# Altium schematic sheet UC3842第三版.SchDoc
size 457 x 241 mm; SheetNumber: 1; SheetTotal: 1
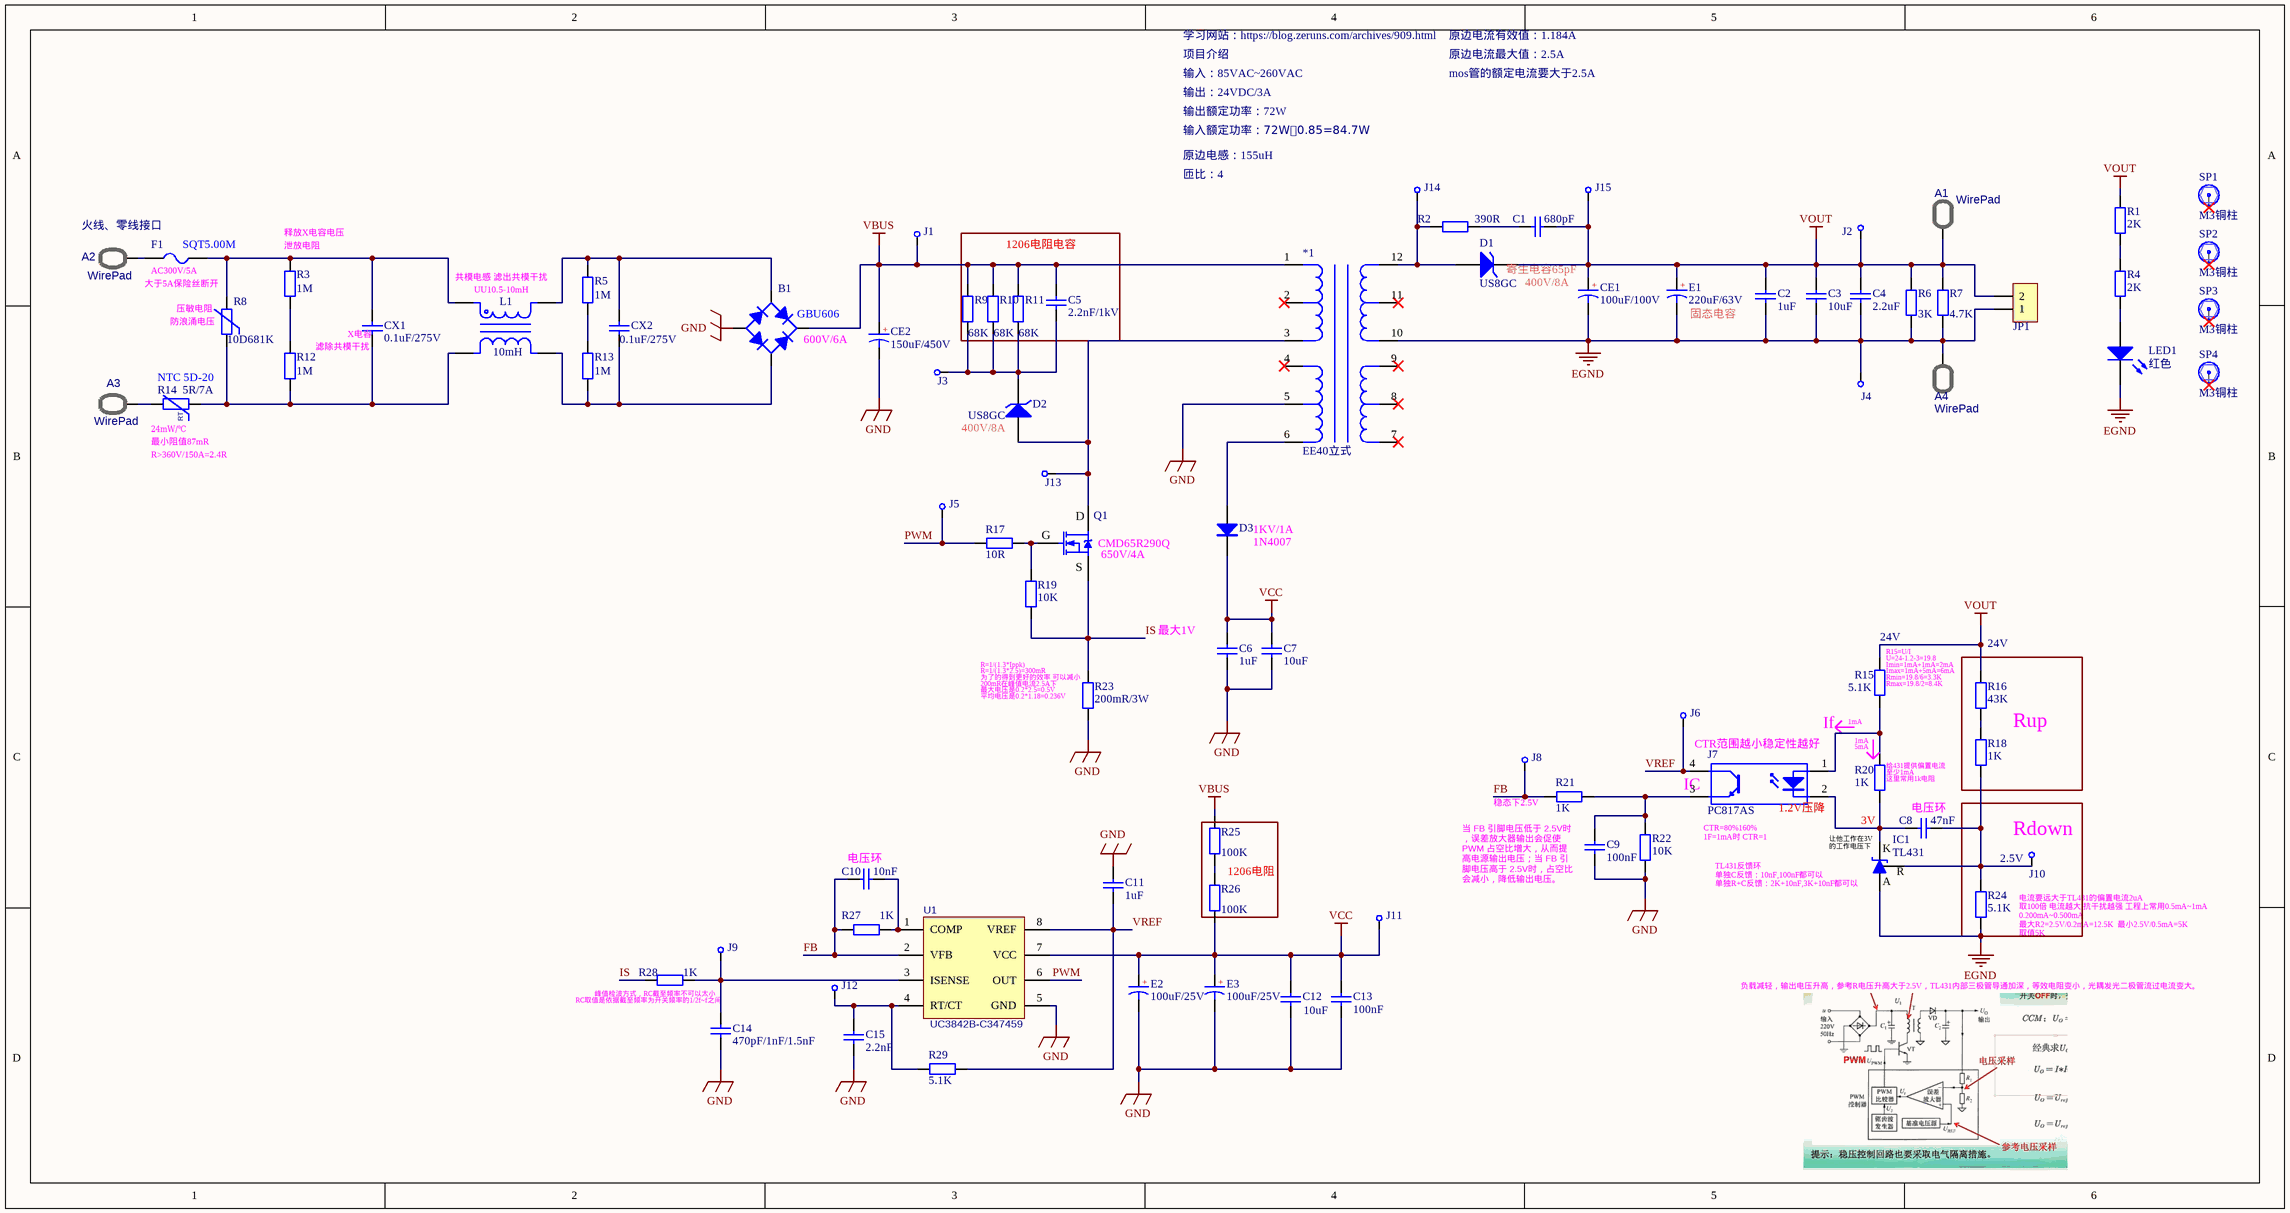
[diagram p0: UC3842第三版.SchDoc]

## Parts
*1  EE40立式  [EE40立式]
A1  WirePad  [WirePad-4.5x7]  (no BOM)
A2  WirePad  [WirePad-4.5x7]  (no BOM)
A3  WirePad  [WirePad-4.5x7]  (no BOM)
A4  WirePad  [WirePad-4.5x7]  (no BOM)
B1  GBU606  [GBU]
C1  680pF  [C0805_L]
C2  1uF  [C0805_L]
C3  10uF  [C0805_L]
C4  2.2uF  [C0805_L]
C5  2.2nF/1kV  [C0805_L]
C6  1uF  [C0805_L]
C7  10uF  [C0805_L]
C8  47nF  [C0805_L]
C9  100nF  [C0805_L]
C10  10nF  [C0805_L]
C11  1uF  [C0805_L]
C12  10uF  [C0805_L]
C13  100nF  [C0805_L]
C14  470pF/1nF/1.5nF  [C0805_L]
C15  2.2nF  [C0805_L]
CE1  100uF/100V  [CE-5.0*10*16]
CE2  150uF/450V  [CE-7.5*18*35.5-H - BK]
CX1  0.1uF/275V  [CX 10*13*11]
CX2  0.1uF/275V  [CX 10*13*11]
D1  US8GC  [SMC]
D2  US8GC  [SMC]
D3  1N4007  [SMA]
E1  220uF/63V  [CT 5.0*10*13 - R]
E2  100uF/25V  [CE D(6.3*5.4)]
E3  100uF/25V  [CE D(6.3*5.4)]
F1  SQT5.00M  [FUSE-8.5x4.0-392Series]
IC1  TL431  [SOT23-3N]
J1  CHECK  [CHECK-A]  (value not drawn)
J2  CHECK  [CHECK-A]  (value not drawn)
J3  CHECK  [CHECK-A]  (value not drawn)
J4  CHECK  [CHECK-A]  (value not drawn)
J5  CHECK  [CHECK-A]  (value not drawn)
J6  CHECK  [CHECK-A]  (value not drawn)
J7  PC817AS  [SOP4-W2.54_M]
J8  CHECK  [CHECK-A]  (value not drawn)
J9  CHECK  [CHECK-A]  (value not drawn)
J10  CHECK  [CHECK-A]  (value not drawn)
J11  CHECK  [CHECK-A]  (value not drawn)
J12  CHECK  [CHECK-A]  (value not drawn)
J13  CHECK  [CHECK-A]  (value not drawn)
J14  CHECK  [CHECK-A]  (value not drawn)
J15  CHECK  [CHECK-A]  (value not drawn)
JP1  HDR-1X2  [KF301-5.0-2P]  (value not drawn)
L1  10mH  [UU9.8]
LED1  红色  [LED0805_G]
Q1  CMD65R290Q  [TO252]
R1  2K  [R0805_L]
R2  390R  [R0805_L]
R3  1M  [R1206_L]
R4  2K  [R0805_L]
R5  1M  [R1206_L]
R6  3K  [R1206_L]
R7  4.7K  [R1206_L]
R8  10D681K  [VDR 9D-4.5]
R9  68K  [R1206_L]
R10  68K  [R1206_L]
R11  68K  [R1206_L]
R12  1M  [R1206_L]
R13  1M  [R1206_L]
R14  5R/7A  [NTC-5D-20]
R15  5.1K  [R0805_L]
R16  43K  [R0805_L]
R17  10R  [R0805_L]
R18  1K  [R0805_L]
R19  10K  [R0805_L]
R20  1K  [R0805_L]
R21  1K  [R0805_L]
R22  10K  [R0805_L]
R23  200mR/3W  [R2512_M]
R24  5.1K  [R0805_L]
R25  100K  [R1206_L]
R26  100K  [R1206_L]
R27  1K  [R0805_L]
R28  1K  [R0805_L]
R29  5.1K  [R0805_L]
SP1  M3铜柱  [M3x9_L]
SP2  M3铜柱  [M3x9_L]
SP3  M3铜柱  [M3x9_L]
SP4  M3铜柱  [M3x9_L]
U1  UC3842B-C347459  [SOIC-8_150mil]

## Blocks framed on the sheet
1206电阻电容: C5 R9-R11
Rup: R16 R18
1206电阻: R25 R26
Rdown: J10 R24

## Nets
EGND: *1.10 A4.1 C2.1 C3.1 C4.1 CE1.2 E1.2 IC1.3(A) J4.1 JP1.1 LED1.2(K) R6.1 R7.1 R24.1
GND: *1.5 B1.DC- C6.1 C7.1 C9.2 C11.1 C12.2 C13.2 C14.1 C15.1 CE2.2 E2.2 E3.2 R22.2 R23.1 U1.5(GND)
VBUS: *1.1 B1.DC+ C5.2 CE2.1 J1.1 R9.2 R10.2 R11.2 R25.2
VCC: C6.2 C7.2 C12.1 C13.1 D3.2(K) E2.1 E3.1 J11.1 R26.1 U1.7(VCC)
VOUT: A1.1 C1.1 C2.2 C3.2 C4.2 CE1.1 D1.2(K) E1.1 J2.1 J15.1 JP1.2 R1.2 R6.2 R7.2 R15.2 R16.2
FB: C10.2 J8.1 R21.2 R27.1 U1.2(VFB)
IS: Q1.3(S) R19.2 R23.2 R28.1
PWM: J5.1 R17.2 U1.6(OUT)
VREF: C11.2 J6.1 J7.4(C) R29.2 U1.8(VREF)
Net*1_3: *1.3 D2.1(A) J13.1 Q1.2
Net*1_6: *1.6 D3.1(A)
Net*1_12: *1.12 D1.1(A) J14.1 R2.2
NetA2_1: A2.1 F1.2
NetA3_1: A3.1 R14.2
NetB1_AC1: B1.AC1 CX2.2 L1.2 R5.2
NetB1_AC2: B1.AC2 CX2.1 L1.3 R13.1
NetC1_2: C1.2 R2.1
NetC5_1: C5.1 D2.2(K) J3.1 R9.1 R10.1 R11.1
NetC8_1: C8.1 IC1.1(R) J10.1 R18.1 R24.2
NetC8_2: C8.2 IC1.2(K) J7.2(K) R20.1
NetC9_1: C9.1 J7.3(E) R21.1 R22.1
NetC10_1: C10.1 R27.2 U1.1(COMP)
NetC14_2: C14.2 J9.1 R28.2 U1.3(ISENSE)
NetC15_2: C15.2 J12.1 R29.1 U1.4(RT/CT)
NetCX1_1: CX1.1 L1.4 R8.1 R12.1 R14.1
NetCX1_2: CX1.2 F1.1 L1.1 R3.2 R8.2
NetJ7_1: J7.1(A) R15.1 R20.2
NetLED1_1: LED1.1(A) R4.1
NetQ1_1: Q1.1(G) R17.1 R19.1
NetR1_1: R1.1 R4.2
NetR3_1: R3.1 R12.2
NetR5_1: R5.1 R13.2
NetR16_1: R16.1 R18.2
NetR25_1: R25.1 R26.2

Not connected (* = marked no-connect by the designer): *1 2* 4* 7* 8* 9* 11*; SP1 1*; SP2 1*; SP3 1*; SP4 1*

## Notes on the sheet
- 学习网站：https://blog.zeruns.com/archives/909.html
- 项目介绍
- 输入：85VAC~260VAC
- 输出：24VDC/3A
- 原边电流有效值：1.184A
- mos管的额定电流要大于2.5A
- 原边电流最大值：2.5A
- 输出额定功率：72W
- 输入额定功率：72W➗0.85=84.7W
- 原边电感：155uH
- 匝比：4
- (near A2) 火线、零线接口
- (near F1) AC300V/5A
- (near R3) 泄放电阻
- (near R3) 释放X电容电压
- (near L1) 共模电感 滤出共模干扰
- (near D1) 寄生电容65pF
- 大于5A保险丝断开
- (near R8) 防浪涌电压
- 压敏电阻
- 滤除共模干扰
- (near CX1) X电容
- (near L1) UU10.5-10mH
- (near B1) 600V/6A
- 400V/8A
- (near E1) 固态电容
- (near R14) NTC 5D-20
- R>360V/150A=2.4R
- 24mW/℃
- 最小阻值87mR
- (near D2) 400V/8A
- (near D3) 1KV/1A
- (near Q1) 650V/4A
- (near C6) 最大1V
- (near R15) 24V
- (near R15) R15=U/I
- (near R15) U=24-1.2-3=19.8
- (near R16) 24V
- 200mR在峰值电流2.5A下
- (near R23) 最大电压是0.2*2.5=0.5V
- (near R23) 平均电压是0.2*1.18=0.236V
- R=1/(1.3*Ippk)
- R=1/(1.3*2.5)=300mR
- 为了的得到更好的效率 可以减小
- If
- 1mA
- (near R15) Imin=1mA+1mA=2mA
- (near R15) Imax=1mA+5mA=6mA
- (near R15) Rmin=19.8/6=3.3K
- (near R15) Rmax=19.8/2=8.4K
- (near J7) IC
- CTR范围越小稳定性越好
- (near R20) 1mA
- (near R20) 5mA
- (near R20) 给431提供偏置电流
- (near R20) 至少1mA
- (near R20) 这里常用1k电阻
- 稳态下2.5V
- (near J7) CTR=80%160%
  1F=1mA时 CTR=1
- (near J7) 1.2V压降
- (near IC1) 让他工作在3V的工作电压下
- 3V
- (near C8) 电压环
- (near C10) 电压环
- 当 FB 引脚电压低于 2.5V时，误差放大器输出会促使 PWM 占空比增大，从而提高电源输出电压；当 FB 引脚电压高于 2.5V时，占空比会减小，降低输出电压。
- (near IC1) TL431反馈环
  单独C反馈：10nF,100nF都可以
  单独R+C反馈：2K+10nF,3K+10nF都可以
- (near J10) 2.5V
- 电流要远大于TL431的偏置电流2uA
  取100倍 电流越大 抗干扰越强 工程上常用0.5mA~1mA
  0.200mA~0.500mA
  最大R2=2.5V/0.2mA=12.5K  最小2.5V/0.5mA=5K
  取值5K
- (near R28) RC取值是依据截至频率为开关频率的1/2f~f之间
- (near R28) 峰值检波方式，RC截至频率不可以太小
- 负载减轻，输出电压升高，参考R电压升高大于2.5V，TL431内部三极管导通加深，等效电阻变小，光耦发光二极管流过电流变大。
- (in symbol CE) +
- (in symbol CE_SMD) +
- (in symbol CS) +
- (in symbol P40NF10L) D

## Library data of the parts
A1-A4 = WirePad: 线缆焊盘
B1 = GBU: 1KV/10A整流桥; 当前库版本V2025.1.5，下一版本发布时间2025年2月份 @淘宝卖家:黄晶宝石: 最新版本发布网址https://item.taobao.com/item.htm?id=566775463719; BOM名称: 1KV/10A整流桥
C1-C15 = C: 贴片电容/MLCC电容; BOM名称: 无极性贴片电容; 联系下单店铺卖家 免费帮你查找封装: 联系下单店铺卖家 免费技术指导
CE1 CE2 = CE: 直插电解电容; 联系下单店铺卖家 免费帮你查找封装: 联系下单店铺卖家 免费技术指导; BOM名称: 直插电解电容
CX1 CX2 = CX: 安规X电容; BOM名称: X电容; 当前库版本V2025.1.5，下一版本发布时间2025年2月份 @淘宝卖家:黄晶宝石: 最新版本发布网址https://item.taobao.com/item.htm?id=566775463719
D1 D2 = 5.0SMDJ24A: 5000W 24V TVS二极管; BOM名称: TVS瞬态抑制二极管; 当前库版本V2025.1.5，下一版本发布时间2025年2月份 @淘宝卖家:黄晶宝石: 最新版本发布网址https://item.taobao.com/item.htm?id=566775463719; 属性: 5000W 24V TVS
D3 = 1N4007: 整流二极管; 当前库版本V2025.1.5，下一版本发布时间2025年2月份 @淘宝卖家:黄晶宝石: 最新版本发布网址https://item.taobao.com/item.htm?id=566775463719; BOM名称: 整流二极管
E1 = CS: 直插固态电容; 联系下单店铺卖家 免费帮你查找封装: 联系下单店铺卖家 免费技术指导; 当前库版本V2025.1.5，下一版本发布时间2025年2月份 @淘宝卖家:黄晶宝石: 最新版本发布网址https://item.taobao.com/item.htm?id=566775463719; BOM名称: 直插固态电容
E2 E3 = CE_SMD: 贴片电解电容; 当前库版本V2025.1.5，下一版本发布时间2025年2月份 @淘宝卖家:黄晶宝石: 最新版本发布网址https://item.taobao.com/item.htm?id=566775463719; BOM名称: 贴片电解电容
F1 = FUSE-8.5*4.0*8.0: 方形保险丝; BOM名称: 5*20保险丝; 当前库版本V2025.1.5，下一版本发布时间2025年2月份 @淘宝卖家:黄晶宝石: 最新版本发布网址https://item.taobao.com/item.htm?id=566775463719
IC1 = TL431_SMD: 贴片可调基准稳压芯片; 联系下单店铺卖家 免费帮你查找封装: 联系下单店铺卖家 免费技术支持; 当前库版本V2025.1.5，下一版本发布时间2025年2月份 @淘宝卖家:黄晶宝石: 最新版本发布网址https://item.taobao.com/item.htm?id=566775463719; BOM名称: 可调基准稳压芯片
J1-J6 J8-J15 = CHECK: 测试点
J7 = TLP521-1: 1路开关光耦; 封装库来自淘宝卖家：黄晶宝石: 其他店铺购入均为赃物，无售后更新权益，请立即申请退款，退款后现金奖励200~1000元; BOM名称: 1路开关光耦
JP1 = Header 2: 2P接插件; 封装库来自淘宝卖家： 黄晶宝石: 最新版本发布https://shop463601444.taobao.com; BOM名称: 2P接插件
L1 = L-UU: UU型共模电感; BOM名称: 共模电感; 当前库版本V2025.1.5，下一版本发布时间2025年2月份 @淘宝卖家:黄晶宝石: 最新版本发布网址https://item.taobao.com/item.htm?id=566775463719
LED1 = LED: 贴片LED; 封装库来自淘宝卖家：黄晶宝石: 其他店铺购入均为盗版封装库，无更新权益，请立即申请退款，本店现金奖励200~1000元; BOM名称: 贴片LED
Q1 = P40NF10L: N沟道 100V/40A; BOM名称: N沟场效应管; 联系下单店铺卖家 免费帮你查找封装: 联系下单店铺卖家 免费技术支持; 当前库版本V2025.1.5，下一版本发布时间2025年2月份 @淘宝卖家:黄晶宝石: 最新版本发布网址https://item.taobao.com/item.htm?id=566775463719
R1-R7 R9-R13 R15-R29 = R: 贴片电阻; 联系下单店铺卖家 免费帮你查找封装: 联系下单店铺卖家 免费技术指导; BOM名称: 贴片电阻
R8 = R_VSR: 压敏电阻; 当前库版本V2025.1.5，下一版本发布时间2025年2月份 @淘宝卖家:黄晶宝石: 最新版本发布网址https://item.taobao.com/item.htm?id=566775463719; BOM名称: 压敏电阻
R14 = RT: 热敏电阻; BOM名称: 压敏电阻; 当前库版本V2025.1.5，下一版本发布时间2025年2月份 @淘宝卖家:黄晶宝石: 最新版本发布网址https://item.taobao.com/item.htm?id=566775463719
SP1-SP4 = 铜柱小焊盘: 铜柱; 联系下单店铺卖家 免费技术支持: 联系下单店铺卖家 免费帮你查找封装; BOM名称: 铜柱
U1 = UC3842: 开关电源芯片; 当前库版本V2025.1.5，下一版本发布时间2025年2月份 @淘宝卖家:黄晶宝石: 最新版本发布网址https://item.taobao.com/item.htm?id=566775463719; BOM名称: UC3842